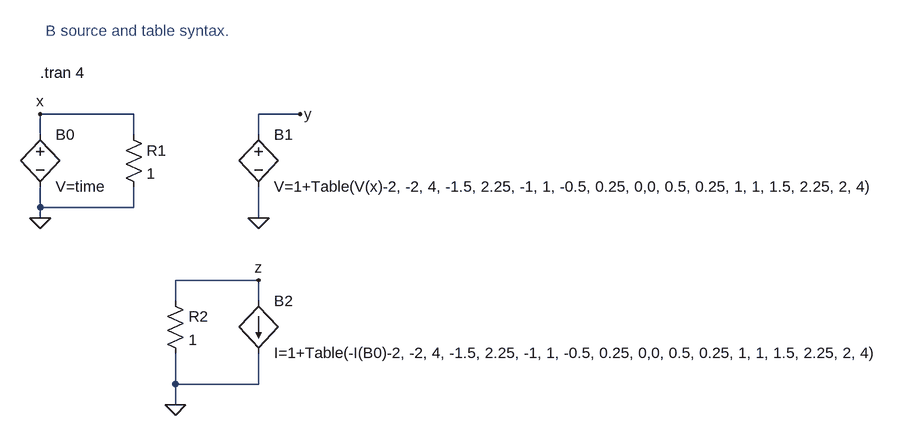
[diagram p0: schematic b1.asc]
b1.asc, the LTspice schematic file:
Version 4
SHEET 1 1216 680
WIRE -192 208 -192 240
WIRE 144 208 144 256
WIRE -192 128 -192 96
WIRE -192 96 -48 96
WIRE 144 128 144 96
WIRE 144 96 208 96
WIRE -48 128 -48 96
WIRE -48 208 -48 240
WIRE -48 240 -192 240
WIRE -192 240 -192 256
WIRE 144 384 144 352
WIRE 144 352 16 352
WIRE 16 352 16 384
WIRE 16 464 16 512
WIRE 16 512 144 512
WIRE 144 512 144 464
WIRE 16 544 16 512
FLAG 144 256 0
FLAG -192 256 0
FLAG 208 96 y
FLAG -192 96 x
FLAG 16 544 0
FLAG 144 352 z
SYMBOL bv 144 112 R0
SYMATTR InstName B1
SYMATTR Value V=1+Table(V(x)-2, -2, 4, -1.5, 2.25, -1, 1, -0.5, 0.25, 0,0, 0.5, 0.25, 1, 1, 1.5, 2.25, 2, 4)
SYMBOL bv -192 112 R0
SYMATTR InstName B0
SYMATTR Value V=time
SYMBOL res -64 112 R0
SYMATTR InstName R1
SYMATTR Value 1
SYMBOL bi 144 384 R0
SYMATTR InstName B2
SYMATTR Value I=1+Table(-I(B0)-2, -2, 4, -1.5, 2.25, -1, 1, -0.5, 0.25, 0,0, 0.5, 0.25, 1, 1, 1.5, 2.25, 2, 4)
SYMBOL res 0 368 R0
SYMATTR InstName R2
SYMATTR Value 1
TEXT -192 32 Left 0 !.tran 4
TEXT -184 -32 Left 0 ;B source and table syntax.

The netlist it stands for:
* b1.asc
B1 y 0 V=1+Table(V(x)-2, -2, 4, -1.5, 2.25, -1, 1, -0.5, 0.25, 0,0, 0.5, 0.25, 1, 1, 1.5, 2.25, 2, 4)
B0 x 0 V=time
R1 x 0 1
B2 z 0 I=1+Table(-I(B0)-2, -2, 4, -1.5, 2.25, -1, 1, -0.5, 0.25, 0,0, 0.5, 0.25, 1, 1, 1.5, 2.25, 2, 4)
R2 z 0 1
.tran 4
* B source and table syntax.
.backanno
.end